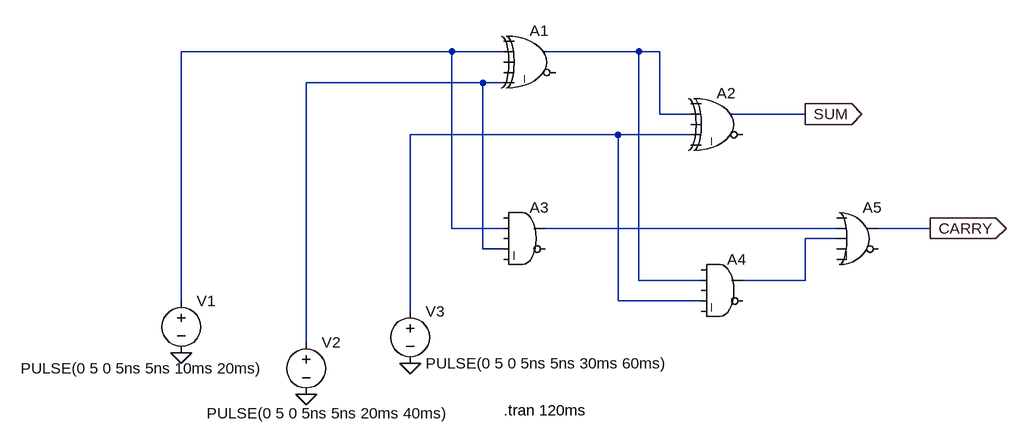
[diagram p0: schematic Full adder.asc]
Full adder.asc, the LTspice schematic file:
Version 4
SHEET 1 940 680
WIRE 64 -16 -352 -16
WIRE 144 -16 64 -16
WIRE 352 -16 208 -16
WIRE 384 -16 352 -16
WIRE 112 32 -160 32
WIRE 144 32 112 32
WIRE 384 80 384 -16
WIRE 432 80 384 80
WIRE 608 80 496 80
WIRE 320 112 0 112
WIRE 432 112 320 112
WIRE 64 256 64 -16
WIRE 144 256 64 256
WIRE 656 256 208 256
WIRE 800 256 720 256
WIRE 656 272 608 272
WIRE 112 288 112 32
WIRE 144 288 112 288
WIRE 352 336 352 -16
WIRE 448 336 352 336
WIRE 608 336 608 272
WIRE 608 336 512 336
WIRE -352 368 -352 -16
WIRE 320 368 320 112
WIRE 448 368 320 368
WIRE 0 384 0 112
WIRE -160 432 -160 32
FLAG 608 80 SUM
IOPIN 608 80 Out
FLAG 800 256 CARRY
IOPIN 800 256 Out
FLAG -352 448 0
FLAG -160 512 0
FLAG 0 464 0
SYMBOL Digital\\xor 192 -64 R0
SYMATTR InstName A1
SYMBOL Digital\\xor 480 32 R0
SYMATTR InstName A2
SYMBOL Digital\\and 176 208 R0
SYMATTR InstName A3
SYMBOL Digital\\and 480 288 R0
SYMATTR InstName A4
SYMBOL Digital\\or 688 208 R0
SYMATTR InstName A5
SYMBOL voltage -352 352 R0
WINDOW 3 -247 120 Left 2
WINDOW 123 0 0 Left 0
WINDOW 39 0 0 Left 0
SYMATTR Value PULSE(0 5 0 5ns 5ns 10ms 20ms)
SYMATTR InstName V1
SYMBOL voltage -160 416 R0
WINDOW 3 -153 125 Left 2
WINDOW 123 0 0 Left 0
WINDOW 39 0 0 Left 0
SYMATTR Value PULSE(0 5 0 5ns 5ns 20ms 40ms)
SYMATTR InstName V2
SYMBOL voltage 0 368 R0
WINDOW 123 0 0 Left 0
WINDOW 39 0 0 Left 0
SYMATTR InstName V3
SYMATTR Value PULSE(0 5 0 5ns 5ns 30ms 60ms)
TEXT 144 536 Left 2 !.tran 120ms

The netlist it stands for:
* Full adder.asc
A1 0 N001 0 0 N003 0 N002 0 XOR
A2 0 N002 0 N004 0 0 SUM 0 XOR
A3 0 N001 0 N003 0 0 N005 0 AND
A4 0 N002 0 N004 0 0 N006 0 AND
A5 0 N005 N006 0 0 0 CARRY 0 OR
V1 N001 0 PULSE(0 5 0 5ns 5ns 10ms 20ms)
V2 N003 0 PULSE(0 5 0 5ns 5ns 20ms 40ms)
V3 N004 0 PULSE(0 5 0 5ns 5ns 30ms 60ms)
.tran 120ms
.backanno
.end